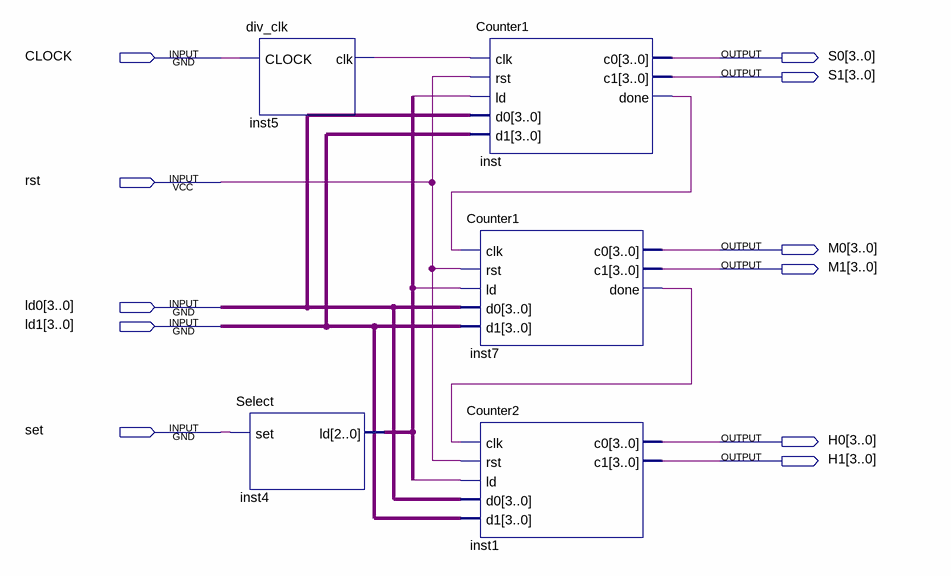
[diagram p0: schematic sheet]
// Quartus schematic Clock.bdf as structural Verilog: 5 symbols, 11 pins
module Clock (
  input  CLOCK,
  input  rst,
  input  [3:0] ld0,
  input  [3:0] ld1,
  input  set,
  output [3:0] S0,
  output [3:0] S1,
  output [3:0] M0,
  output [3:0] M1,
  output [3:0] H0,
  output [3:0] H1
);

  wire inst5_clk, inst7_done, inst_done, undriven, undriven_2, undriven_3;
  wire [2:0] inst4_ld;

  div_clk inst5 (.CLOCK(CLOCK), .clk(inst5_clk));
  Select inst4 (.set(set), .ld(inst4_ld));
  Counter1 inst (.clk(inst5_clk), .rst(rst), .ld(undriven_3), .d0(ld0), .d1(ld1), .c0(S0), .c1(S1), .done(inst_done));
  Counter1 inst7 (.clk(inst_done), .rst(rst), .ld(undriven_2), .d0(ld0), .d1(ld1), .c0(M0), .c1(M1), .done(inst7_done));
  Counter2 inst1 (.clk(inst7_done), .rst(rst), .ld(undriven), .d0(ld0), .d1(ld1), .c0(H0), .c1(H1));
endmodule
